# Altium project JO.PrjPcb
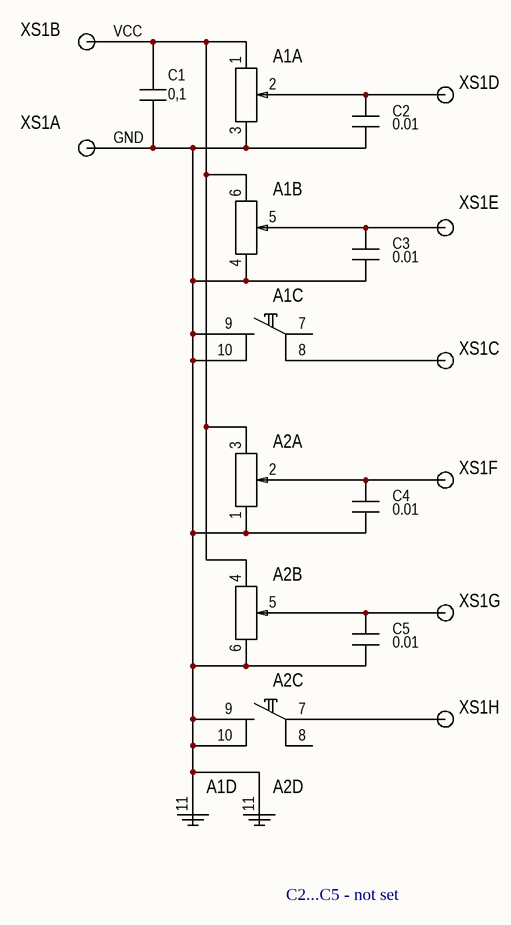
[diagram p0: JO.SchDoc]
1 sheet, 8 parts. Net scope: global (net labels, ports and power ports of the same name join across sheets).
Board file: JO.PcbDoc

## Sheet JO.SchDoc
size 209 x 297 mm; Scale: {Масш.}; Title1str: {Наименование}; PageSetup: Record=PageOptions|CenterHorizontal=False|CenterVertical=False|PrintScale=0.95|XCorrection=0.00|YCorrection=0.00|PrintKind=1|BorderSize=5000000|LeftOffset=0|BottomOffset=0|Orientation=1|PaperLength=1000|PaperWidth=1000|Scale=100|PaperSource=15|PrintQuality=600|MediaType=1|DitherType=10|PaperKind=A4|PrintScaleMode=1; Title2str: {Наименование}; ProcessInspection: {Т.контр.}; Mass: {Масса}; NormInspection: {Н.контр.}; EngineerName: {Инженер}; Letter1Column: {}; Letter2Column: {}; Letter3Column: {}; DocumentType: {Документ}; DocumentType1str: {Документ}; DocumentType2str: {Документ}

### Parts
A1  Kalih  [Kalih]  (value not drawn)  (parts A,B,C,D of 4)
A2  Kalih  [Kalih]  (value not drawn)  (parts A,B,C,D of 4)
C1  Ёмкость: 0,1  [cap_0805]  (hidden comment: Cap_SMD0805)
C2  Ёмкость: 0.01  [cap_0805]  (hidden comment: Cap_SMD0805)
C3  Ёмкость: 0.01  [cap_0805]  (hidden comment: Cap_SMD0805)
C4  Ёмкость: 0.01  [cap_0805]  (hidden comment: Cap_SMD0805)
C5  Ёмкость: 0.01  [cap_0805]  (hidden comment: Cap_SMD0805)
XS1  XS8  [8H_2.5mm]  (value not drawn)  (parts A,B,C,D,E,F,G,H of 8)

### Nets
GND: A1.3 A1.4 A1.9 A1.10 A1.11 A2.1 A2.6 A2.9 A2.10 A2.11 C1.1 C2.1 C3.1 C4.1 C5.1 XS1.1
VCC: A1.1 A1.6 A2.3 A2.4 C1.2 XS1.2
NetA1_2: A1.2 C2.2 XS1.4
NetA1_5: A1.5 C3.2 XS1.5
NetA1_8: A1.8 XS1.3
NetA2_2: A2.2 C4.2 XS1.6
NetA2_5: A2.5 C5.2 XS1.7
NetA2_7: A2.7 XS1.8

Not connected (* = marked no-connect by the designer): A1 7; A2 8

### Notes on the sheet
- C2...C5 - not set
- Перв. примен.
- Справ. №
- Подп. и дата
- Инв. № дубл.
- Взам. инв. №
- Изм.
- Лист
- № докум.
- Подп.
- Дата
- Лит.
- Масса
- Масштаб
- Т.контр.
- Пров.
- Разраб.
- Листов
- Инв. № подл.
- Н.контр.
- Утв.